# Altium project TankTurret.PrjPcb
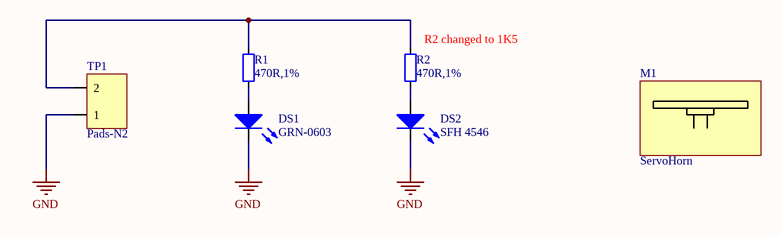
[diagram p0: Top.SchDoc]
Project_Revision: 1.0; Project_Board_Name: A7V Tank Turret
1 sheet, 6 parts. Net scope: global (net labels, ports and power ports of the same name join across sheets).
Board file: TankTurret.PcbDoc

## Sheet Top.SchDoc: Top Level
size A3; CompanyName: NOT USED; DocumentNumber: 1; SheetNumber: 1; SheetTotal: 1; PageSetup: Record=PageOptions|CenterHorizontal=True|CenterVertical=True|PrintScale=1.00|XCorrection=1.00|YCorrection=1.00|PrintKind=0|BorderSize=5000000|LeftOffset=0|BottomOffset=0|Orientation=2|PaperLength=1000|PaperWidth=1000|Scale=100|PaperSource=7|PrintQuality=-4|MediaType=1|DitherType=10|PaperKind=A3|PrintScaleMode=0

### Parts
DS1  GRN-0603  [LED_SML-LX0603]
DS2  SFH 4546  [P375-504]
M1  ServoHorn  [SERVO_HORN]
R1  470R,1%  [RESC1608X06N_0603]
R2  470R,1%  [RESC1608X06N_0603]
TP1  Pads-N2  [PADS-N2]

### Nets
GND: DS1.1(C) DS2.1(C) TP1.1
NetDS1_2: DS1.2(A) R1.1
NetDS2_2: DS2.2(A) R2.1
NetR1_2: R1.2 R2.2 TP1.2

### Notes on the sheet
- (near R2) R2 changed to 1K5
- Project
- Size:
- Date:
- A3
- Revision:
- Sheet
- of
- Lambo
- File:

### Library data of the parts
DS1 = LED-10087-A: LED GREEN CLEAR 0603 SMD; Manufacturer: Dialight; Manufacturer Part Number: 5988081107F; Wavelength: 523nm; Axial Intensity: 300mcd; If(max): 20mA; Lens Style/Size: 0603; Vf@I: 3.2V; Viewing Angle: 140; Display_Name: GRN-0603; BWA PN: LED-10087-A; Colour: GREEN; Lens type: clear; Vr(max): -; Schematic Symbol: LED_1; Supplier 1: Digi-Key; Supplier Part Number 1: 350-2036-1-ND
DS2 = LED-10072-A: EMITTER IR 940NM 100MA RADIAL; Manufacturer: Osram; Axial Intensity: 130 mw/sr@100mA; Lens type: Black; Lens Style/Size: T-1 3/4 5mm RA; Vf@I: 1.5V; Viewing Angle: +/-20°; Vr(max): 5V; Display_Name: SFH 4546; Wavelength: 940nm; BWA PN: LED-10072-A; Colour: IR; If(max): 100mA; Schematic Symbol: LED_1; Manufacturer Part Number: SFH 4546; Supplier 1: Digi-Key; Supplier Part Number 1: 475-2870-ND
R1 R2 = RSH-470R0-D: RES 470 OHM 1/10W 1% 0603 SMD; Manufacturer: Rohm Semiconductor; Manufacturer Part Number: MCR03EZPFX4700; Power: 0.1W; Display_Name: 470R,1%; Resistance: 470R; Tolerance: 1%; Type: Chip; BWA PN: RSH-470R0-D; Schematic Symbol: RESISTOR_1; Supplier 1: Digi-Key; Supplier Part Number 1: RHM470HCT-ND

## Assembly variants
Default: not fitted J2 J3